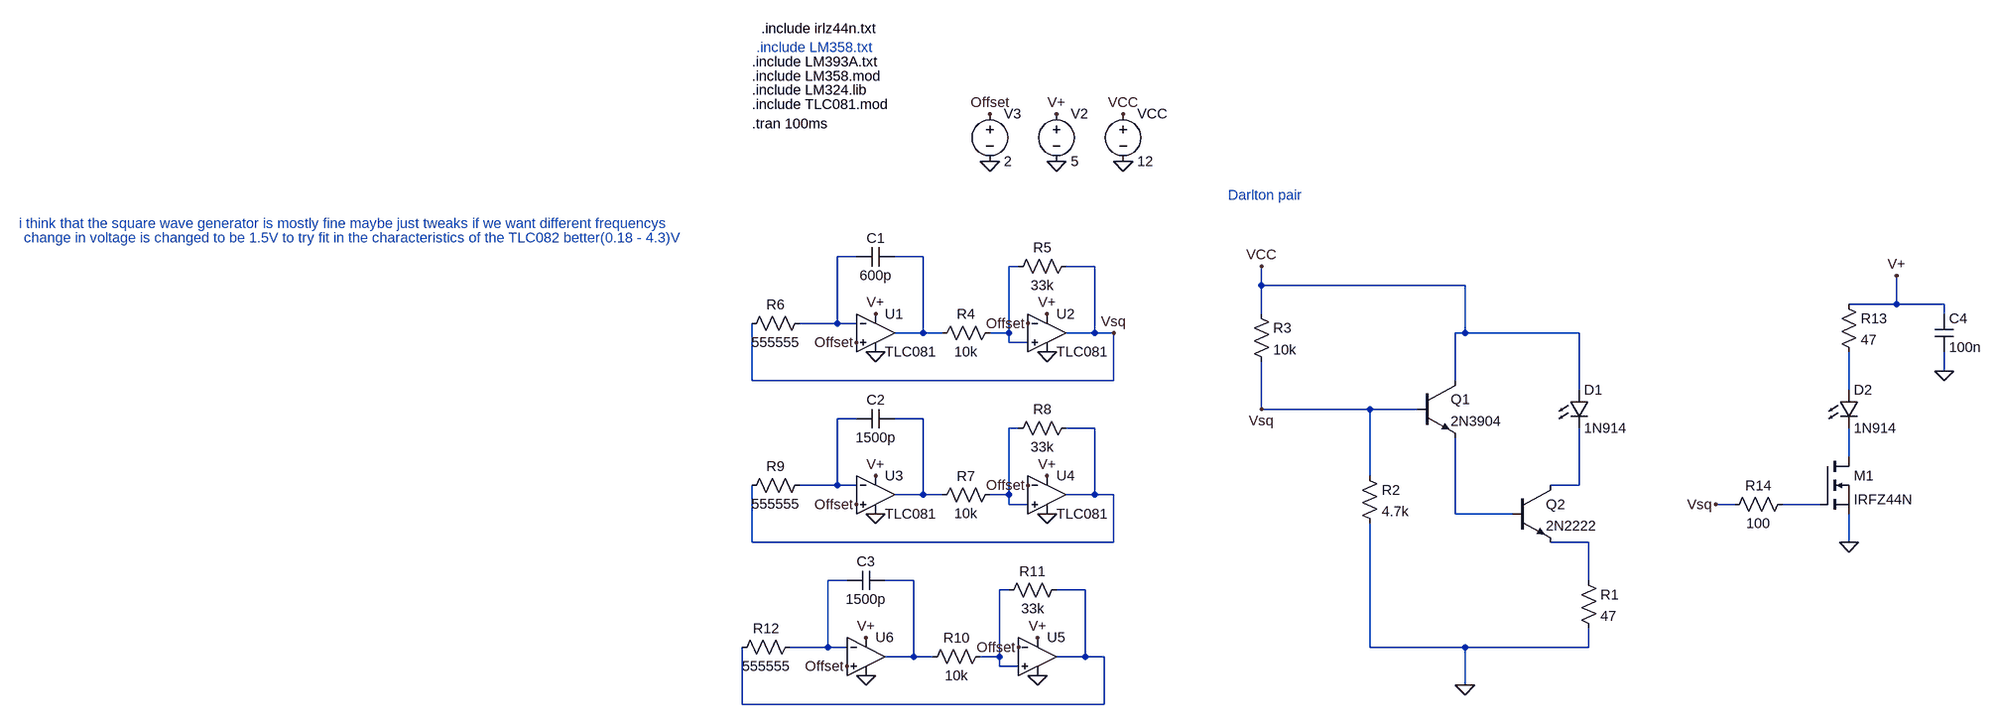
[diagram p0: schematic LED driver draft.asc]
LED driver draft.asc, the LTspice schematic file:
Version 4.1
SHEET 1 2024 1268
WIRE -960 0 -992 0
WIRE -848 0 -896 0
WIRE -688 16 -704 16
WIRE -560 16 -608 16
WIRE -48 48 -48 16
WIRE 304 48 -48 48
WIRE 1296 80 1296 32
WIRE 1296 80 1216 80
WIRE 1376 80 1296 80
WIRE -48 96 -48 48
WIRE 1376 96 1376 80
WIRE -992 112 -992 0
WIRE -992 112 -1056 112
WIRE -960 112 -992 112
WIRE -848 128 -848 0
WIRE -848 128 -896 128
WIRE -816 128 -848 128
WIRE -704 128 -704 16
WIRE -704 128 -736 128
WIRE -560 128 -560 16
WIRE -560 128 -608 128
WIRE -528 128 -560 128
WIRE 304 128 304 48
WIRE 304 128 288 128
WIRE 496 128 304 128
WIRE -704 144 -704 128
WIRE -672 144 -704 144
WIRE 1376 192 1376 160
WIRE -1136 208 -1136 112
WIRE -528 208 -528 128
WIRE -528 208 -1136 208
WIRE 288 208 288 128
WIRE 496 224 496 128
WIRE 1216 224 1216 160
WIRE -48 256 -48 176
WIRE 144 256 -48 256
WIRE 224 256 144 256
WIRE -960 272 -992 272
WIRE -848 272 -896 272
WIRE -688 288 -704 288
WIRE -560 288 -608 288
WIRE 1216 336 1216 288
WIRE 144 368 144 256
WIRE -992 384 -992 272
WIRE -992 384 -1056 384
WIRE -960 384 -992 384
WIRE 496 384 496 288
WIRE 496 384 448 384
WIRE -848 400 -848 272
WIRE -848 400 -896 400
WIRE -816 400 -848 400
WIRE -704 400 -704 288
WIRE -704 400 -736 400
WIRE -560 400 -560 288
WIRE -560 400 -608 400
WIRE -528 400 -560 400
WIRE -704 416 -704 400
WIRE -672 416 -704 416
WIRE 1024 416 992 416
WIRE 1168 416 1104 416
WIRE 288 432 288 304
WIRE 384 432 288 432
WIRE -1136 480 -1136 384
WIRE -528 480 -528 400
WIRE -528 480 -1136 480
WIRE 512 480 448 480
WIRE 1216 480 1216 432
WIRE -976 544 -1008 544
WIRE -864 544 -912 544
WIRE 512 544 512 480
WIRE -704 560 -720 560
WIRE -576 560 -624 560
WIRE -1008 656 -1008 544
WIRE -1008 656 -1072 656
WIRE -976 656 -1008 656
WIRE 144 656 144 448
WIRE 304 656 144 656
WIRE 512 656 512 624
WIRE 512 656 304 656
WIRE -864 672 -864 544
WIRE -864 672 -912 672
WIRE -832 672 -864 672
WIRE -720 672 -720 560
WIRE -720 672 -752 672
WIRE -576 672 -576 560
WIRE -576 672 -624 672
WIRE -544 672 -576 672
WIRE -720 688 -720 672
WIRE -688 688 -720 688
WIRE 304 720 304 656
WIRE -1152 752 -1152 656
WIRE -544 752 -544 672
WIRE -544 752 -1152 752
FLAG 304 720 0
FLAG -624 -240 V+
FLAG -736 -240 Offset
FLAG -624 -160 0
FLAG -736 -160 0
FLAG -928 160 0
FLAG -640 160 0
FLAG -928 96 V+
FLAG -640 96 V+
FLAG -960 144 Offset
FLAG -672 112 Offset
FLAG -512 -160 0
FLAG -512 -240 VCC
FLAG -48 16 VCC
FLAG -928 432 0
FLAG -640 432 0
FLAG -928 368 V+
FLAG -640 368 V+
FLAG -960 416 Offset
FLAG -672 384 Offset
FLAG -944 704 0
FLAG -656 704 0
FLAG -944 640 V+
FLAG -656 640 V+
FLAG -976 688 Offset
FLAG -688 656 Offset
FLAG -528 128 Vsq
FLAG -48 256 Vsq
FLAG 1296 32 V+
FLAG 1216 480 0
FLAG 1376 192 0
FLAG 992 416 Vsq
SYMBOL LED 480 224 R0
SYMATTR InstName D1
SYMATTR Value 1N914
SYMBOL npn 224 208 R0
SYMATTR InstName Q1
SYMATTR Value 2N3904
SYMBOL npn 384 384 R0
SYMATTR InstName Q2
SYMATTR Value 2N2222
SYMBOL res 496 528 R0
SYMATTR InstName R1
SYMATTR Value 47
SYMBOL res 128 352 R0
SYMATTR InstName R2
SYMATTR Value 4.7k
SYMBOL res -64 80 R0
SYMATTR InstName R3
SYMATTR Value 10k
SYMBOL voltage -512 -256 R0
WINDOW 123 0 0 Left 0
WINDOW 39 0 0 Left 0
SYMATTR InstName VCC
SYMATTR Value 12
SYMBOL OpAmps\\opamp2 -928 64 R0
SYMATTR InstName U1
SYMATTR Value TLC081
SYMBOL OpAmps\\opamp2 -640 64 R0
SYMATTR InstName U2
SYMATTR Value TLC081
SYMBOL voltage -624 -256 R0
WINDOW 123 0 0 Left 0
WINDOW 39 0 0 Left 0
SYMATTR InstName V2
SYMATTR Value 5
SYMBOL voltage -736 -256 R0
WINDOW 123 0 0 Left 0
WINDOW 39 0 0 Left 0
SYMATTR InstName V3
SYMATTR Value 2
SYMBOL cap -896 -16 R90
WINDOW 0 0 32 VBottom 2
WINDOW 3 32 32 VTop 2
SYMATTR InstName C1
SYMATTR Value 600p
SYMBOL res -720 112 R90
WINDOW 0 0 56 VBottom 2
WINDOW 3 32 56 VTop 2
SYMATTR InstName R4
SYMATTR Value 10k
SYMBOL res -592 0 R90
WINDOW 0 0 56 VBottom 2
WINDOW 3 32 56 VTop 2
SYMATTR InstName R5
SYMATTR Value 33k
SYMBOL res -1040 96 R90
WINDOW 0 0 56 VBottom 2
WINDOW 3 32 56 VTop 2
SYMATTR InstName R6
SYMATTR Value 555555
SYMBOL OpAmps\\opamp2 -928 336 R0
SYMATTR InstName U3
SYMATTR Value TLC081
SYMBOL OpAmps\\opamp2 -640 336 R0
SYMATTR InstName U4
SYMATTR Value TLC081
SYMBOL cap -896 256 R90
WINDOW 0 0 32 VBottom 2
WINDOW 3 32 32 VTop 2
SYMATTR InstName C2
SYMATTR Value 1500p
SYMBOL res -720 384 R90
WINDOW 0 0 56 VBottom 2
WINDOW 3 32 56 VTop 2
SYMATTR InstName R7
SYMATTR Value 10k
SYMBOL res -592 272 R90
WINDOW 0 0 56 VBottom 2
WINDOW 3 32 56 VTop 2
SYMATTR InstName R8
SYMATTR Value 33k
SYMBOL res -1040 368 R90
WINDOW 0 0 56 VBottom 2
WINDOW 3 32 56 VTop 2
SYMATTR InstName R9
SYMATTR Value 555555
SYMBOL cap -912 528 R90
WINDOW 0 0 32 VBottom 2
WINDOW 3 32 32 VTop 2
SYMATTR InstName C3
SYMATTR Value 1500p
SYMBOL res -736 656 R90
WINDOW 0 0 56 VBottom 2
WINDOW 3 32 56 VTop 2
SYMATTR InstName R10
SYMATTR Value 10k
SYMBOL res -608 544 R90
WINDOW 0 0 56 VBottom 2
WINDOW 3 32 56 VTop 2
SYMATTR InstName R11
SYMATTR Value 33k
SYMBOL res -1056 640 R90
WINDOW 0 0 56 VBottom 2
WINDOW 3 32 56 VTop 2
SYMATTR InstName R12
SYMATTR Value 555555
SYMBOL OpAmps\\UniversalOpAmp2 -656 672 R0
SYMATTR InstName U5
SYMBOL OpAmps\\UniversalOpAmp2 -944 672 R0
SYMATTR InstName U6
SYMBOL nmos 1168 336 R0
SYMATTR InstName M1
SYMATTR Value IRFZ44N
SYMBOL LED 1200 224 R0
SYMATTR InstName D2
SYMATTR Value 1N914
SYMBOL res 1200 64 R0
SYMATTR InstName R13
SYMATTR Value 47
SYMBOL cap 1360 96 R0
SYMATTR InstName C4
SYMATTR Value 100n
SYMBOL res 1120 400 R90
WINDOW 0 0 56 VBottom 2
WINDOW 3 32 56 VTop 2
SYMATTR InstName R14
SYMATTR Value 100
TEXT -1136 -224 Left 2 !.tran 100ms
TEXT -1136 -256 Left 2 !.include TLC081.mod
TEXT -1136 -280 Left 2 !.include LM324.lib
TEXT -1136 -304 Left 2 !.include LM358.mod
TEXT -1136 -328 Left 2 !.include LM393A.txt
TEXT -1128 -352 Left 2 ;.include LM358.txt
TEXT -2384 -56 Left 2 ;i think that the square wave generator is mostly fine maybe just tweaks if we want different frequencys
TEXT -2376 -32 Left 2 ;change in voltage is changed to be 1.5V to try fit in the characteristics of the TLC082 better(0.18 - 4.3)V
TEXT -104 -104 Left 2 ;Darlton pair
TEXT -1120 -384 Left 2 !.include irlz44n.txt

The netlist it stands for:
* LED driver draft.asc
D1 VCC N010 1N914
Q1 VCC Vsq N012 0 2N3904
Q2 N010 N012 N013 0 2N2222
R1 N013 0 47
R2 Vsq 0 4.7k
R3 VCC Vsq 10k
VCC VCC 0 12
X§U1 Offset N001 V+ 0 N002 TLC081  ; pins In+ In- V+ V- OUT
X§U2 N003 Offset V+ 0 Vsq TLC081  ; pins In+ In- V+ V- OUT
V2 V+ 0 5
V3 Offset 0 2
C1 N002 N001 600p
R4 N003 N002 10k
R5 Vsq N003 33k
R6 N001 Vsq 555555
X§U3 Offset N005 V+ 0 N006 TLC081  ; pins In+ In- V+ V- OUT
X§U4 N007 Offset V+ 0 N008 TLC081  ; pins In+ In- V+ V- OUT
C2 N006 N005 1500p
R7 N007 N006 10k
R8 N008 N007 33k
R9 N005 N008 555555
C3 N015 N014 1500p
R10 N016 N015 10k
R11 N017 N016 33k
R12 N014 N017 555555
X§U5 N016 Offset V+ 0 N017 level2 Avol=1Meg GBW=10Meg Slew=10Meg Ilimit=25m Rail=0 Vos=0 En=0 Enk=0 In=0 Ink=0 Rin=500Meg  ; pins In+ In- V+ V- OUT
X§U6 Offset N014 V+ 0 N015 level2 Avol=1Meg GBW=10Meg Slew=10Meg Ilimit=25m Rail=0 Vos=0 En=0 Enk=0 In=0 Ink=0 Rin=500Meg  ; pins In+ In- V+ V- OUT
M1 N009 N011 0 0 IRFZ44N
D2 N004 N009 1N914
R13 V+ N004 47
C4 V+ 0 100n
R14 N011 Vsq 100
.model D D
.lib standard.dio
.model NPN NPN
.model PNP PNP
.lib standard.bjt
.model NMOS NMOS
.model PMOS PMOS
.lib standard.mos
.tran 100ms
.include TLC081.mod
.include LM324.lib
.include LM358.mod
.include LM393A.txt
* .include LM358.txt
* i think that the square wave generator is mostly fine maybe just tweaks if we want different frequencys
* change in voltage is changed to be 1.5V to try fit in the characteristics of the TLC082 better(0.18 - 4.3)V
* Darlton pair
.include irlz44n.txt
.lib UniversalOpAmp2.lib
.backanno
.end